# EAGLE design INKY.PCB (EAGLE 6.5.0)
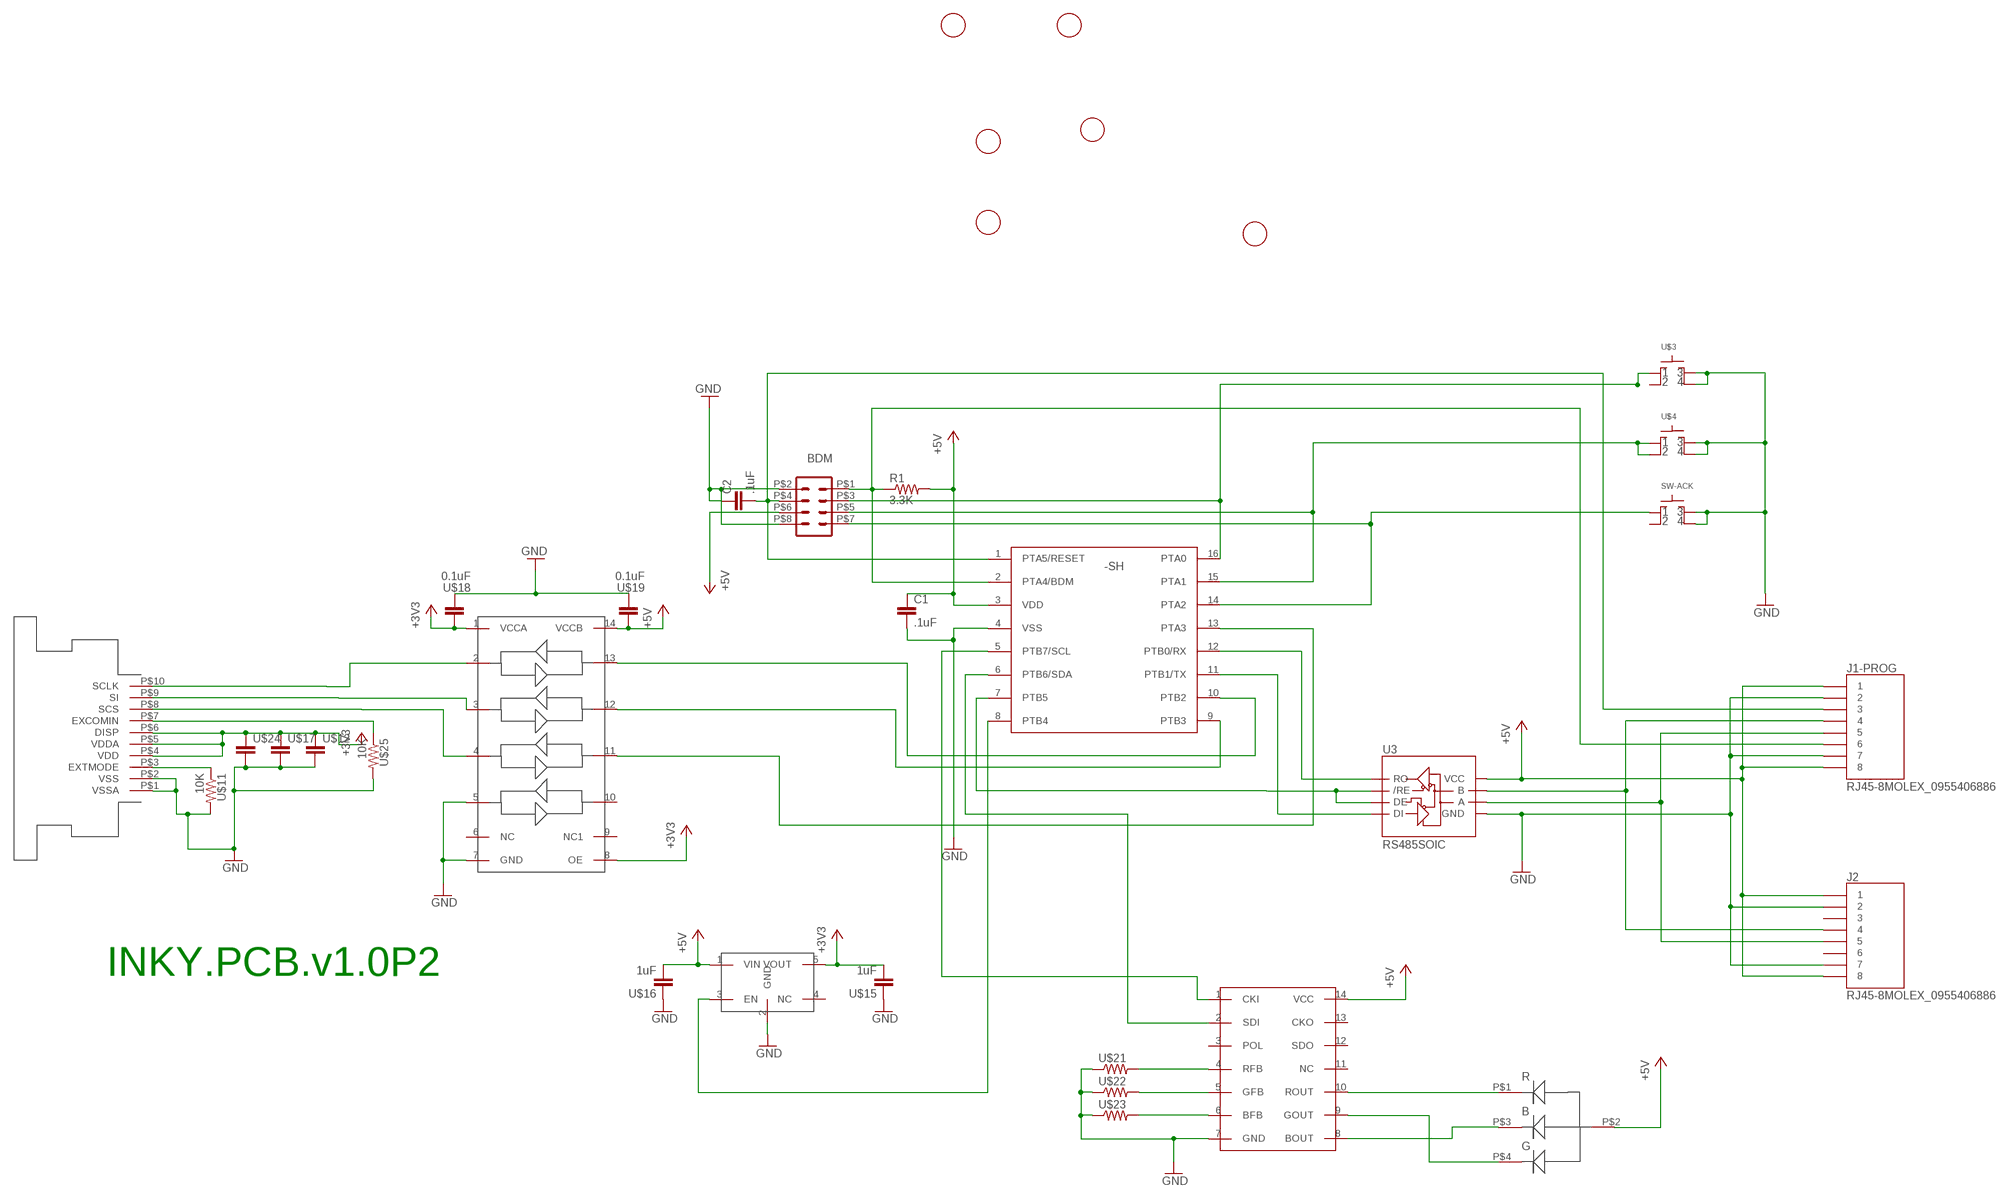
[diagram p0: schematic, sheet 1]

## Parts
BDM  TP2X4SMD  [SMD4X2]
C1  .1uF  RF-C0805  [C0805]
C2  .1uF  RF-C0805  [C0805]
J1-PROG  RJ45-8MOLEX_0955406886  [RJ45_GUIDE]
J2  RJ45-8MOLEX_0955406886  [RJ45_GUIDE]
R1  3.3K  RF-R0805  [RF-C0805]
SW-ACK  SWITCH-TACTILE-5E/5GSH9  [SWITCH_TACTILE-5E/5GSH9]
U1  MC9S08SH8CTG  [TSSOP16]
U3  RS485SOIC  [SO08]
U$1  FIDUCIAL  [FIDUCIAL_1MM]
U$2  FIDUCIAL  [FIDUCIAL_1MM]
U$3  SWITCH-TACTILE  [ESWITCH-TL3301PF]
U$4  SWITCH-TACTILE  [ESWITCH-TL3301PF]
U$5  WS2801  [SO14]
U$6  FIDUCIAL  [FIDUCIAL_1MM]
U$7  FIDUCIAL  [FIDUCIAL_1MM]
U$8  FIDUCIAL  [FIDUCIAL_1MM]
U$9  FIDUCIAL  [FIDUCIAL_1MM]
U$10  52745-1097  [FPC]
U$11  10K  RF-R0805  [RF-C0805]
U$12  RF-C0805  [C0805]
U$13  AAT3221IGV-3.3-T1  [SOT23-5]
U$14  TXB0104  [PW_R-PDSO-G14]
U$15  1uF  RF-C0805  [C0805]
U$16  1uF  RF-C0805  [C0805]
U$17  RF-C0805  [C0805]
U$18  0.1uF  RF-C0805  [C0805]
U$19  0.1uF  RF-C0805  [C0805]
U$20  RGLBED  [PLCC4_SMALL]
U$21  RF-R0805  [RF-C0805]
U$22  RF-R0805  [RF-C0805]
U$23  RF-R0805  [RF-C0805]
U$24  RF-C0805  [C0805]
U$25  10K  RF-R0805  [RF-C0805]

## Nets
485N: J1-PROG.P$4 J2.P$4 U3.7(B)
485P: J1-PROG.P$5 J2.P$5 U3.6(A)
+5V [+5V]: BDM.P$6 C1.1 J1-PROG.P$1 J1-PROG.P$8 J2.P$1 J2.P$8 R1.2 U1.3(VDD) U3.8(VCC) U$5.14(VCC) U$13.1(VIN) U$14.14(VCCB) U$16.2 U$19.1 U$20.P$2(ANODE)
ACK: BDM.P$7 SW-ACK.P$1 U1.14(PTA2)
BDM: BDM.P$1 J1-PROG.P$6 R1.1 U1.2(PTA4/BDM)
DIR: U1.7(PTB5) U3.2(/RE) U3.3(DE)
GMD [+3V3]: U$10.P$4(VDD) U$10.P$5(VDDA) U$10.P$6(DISP) U$12.1 U$13.5(VOUT) U$14.1(VCCA) U$14.8(OE) U$15.2 U$17.1 U$18.1 U$24.1 ; supply symbol labelled +3V3
GND [GND]: BDM.P$2 BDM.P$8 C1.2 C2.1 J1-PROG.P$2 J1-PROG.P$7 J2.P$2 J2.P$7 SW-ACK.P$3 SW-ACK.P$4 U1.4(VSS) U3.5(GND) U$3.3 U$3.4 U$4.3 U$4.4 U$5.7(GND) U$10.P$1(VSSA) U$10.P$2(VSS) U$11.2 U$12.2 U$13.2(GND) U$14.5 U$14.7(GND) U$15.1 U$16.1 U$17.2 U$18.2 U$19.2 U$21.1 U$22.1 U$23.1 U$24.2 U$25.2
INC_DOWN: BDM.P$3 U1.16(PTA0) U$3.1
INC_UP: BDM.P$5 U1.15(PTA1) U$4.1 U$4.2
N$1: U1.8(PTB4) U$13.3(EN)
N$2: U$10.P$10(SCLK) U$14.2
N$3: U$10.P$9(SI) U$14.3
N$4: U$10.P$8(SCS) U$14.4
N$5: U1.6(PTB6/SDA) U$5.2(SDI)
N$6: U1.5(PTB7/SCL) U$5.1(CKI)
N$7: U$5.10(ROUT) U$20.P$1(RED)
N$8: U$5.9(GOUT) U$20.P$4(GREEN)
N$9: U$5.8(BOUT) U$20.P$3(BLUE)
N$10: U$5.4(RFB) U$21.2
N$11: U$5.5(GFB) U$22.2
N$12: U$5.6(BFB) U$23.2
N$29: U1.9(PTB3) U$14.12
N$30: U1.10(PTB2) U$14.13
N$31: U1.13(PTA3) U$14.11
N$32: U$10.P$3(EXTMODE) U$11.1
N$33: U$10.P$7(EXCOMIN) U$25.1
RST: BDM.P$4 C2.2 J1-PROG.P$3 U1.1(PTA5/RESET)
RX: U1.12(PTB0/RX) U3.1(RO)
TX: U1.11(PTB1/TX) U3.4(DI)
Unconnected: J2.P$3 J2.P$6 SW-ACK.P$2 U$3.2 U$5.3(POL) U$5.11(NC) U$5.12(SDO) U$5.13(CKO) U$13.4(NC) U$14.6(NC) U$14.9(NC1) U$14.10

## Notes on the sheet
- INKY.PCB.v1.0P2

## Library data of the parts
BDM = GW-devices:TP2X4SMD; NOTES: DNP
C1 C2 = GW-devices:RF-C: RF capacitor pads for FSL reference design; MFGN: Murata; MFGP: GRM155R61A104KA01D; PRICE: 0.02
J1-PROG J2 = GW-devices:RJ45-8: RJ45 Jack MFG part number 54602-908lf; PRICE: 0.89
R1 = GW-devices:RF-R: RF resistor pads for FSL reference design; MFGN: Panasonic; MFGP: ERJ-2GEJ332X; PRICE: 0.02
SW-ACK = GW-devices:SWITCH-TACTILE
U1 = GW-devices:MC9S08SH8CTG; MFGN: Freescale; MFGP: MC9S08SH8CTG; PRICE: 2.00
U3 = SparkFun:RS485; MFGN: Texas Instruments; MFGP: SN65HVD1781DR; PRICE: 4.29
U$1 U$2 U$6-U$9 = adafruit:FIDUCIAL: For use by pick and place machines to calibrate the vision/machine, 1mm By microbuilder.eu; NOTES: DNP
U$3 U$4 = GW-devices:SWITCH-TACTILE; MFGN: E-Switch; MFGP: TL3301PF160QG
U$5 = GW-devices:WS2801; MFGN: WorldSemi; MFGP: WS2801
U$10 = KW2:52745-1097; MFGN: Molex; MFGP: 52745-1097
U$11 U$21-U$23 U$25 = GW-devices:RF-R: RF resistor pads for FSL reference design; MFGP: CRCW080510K0FKEB
U$12 = GW-devices:RF-C: RF capacitor pads for FSL reference design; MFGP: C0805C106M4PACTU
U$13 = KW2:AAT3221IGV-3.3-T1
U$14 = texas:TXB0104; MFGN: Texas Instruments; MFGP: TXB0104PWR
U$15 U$16 U$18 U$19 = GW-devices:RF-C: RF capacitor pads for FSL reference design
U$17 = GW-devices:RF-C: RF capacitor pads for FSL reference design; MFGP: 0805YD105KAT2A
U$20 = KW2:RGLBED; MFGN: Cree, Inc.; MFGP: CLV1A-FKB-CK1N1G1BB7R4S3
U$24 = GW-devices:RF-C: RF capacitor pads for FSL reference design; MFGP: 0805YD104KAT2A

## Board
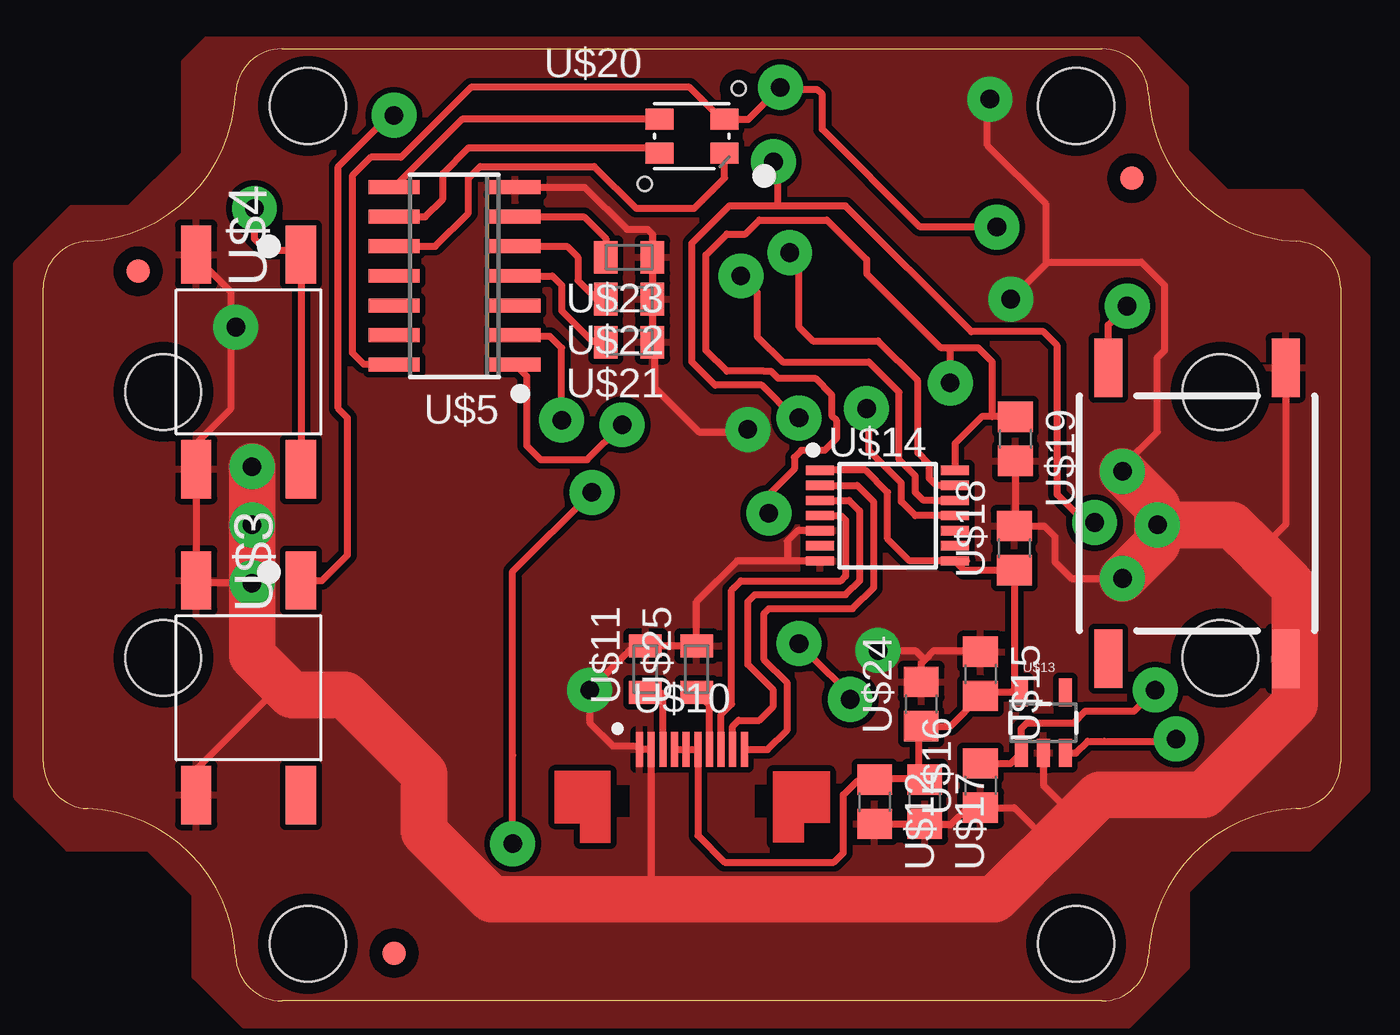
[diagram p1: board, top side]
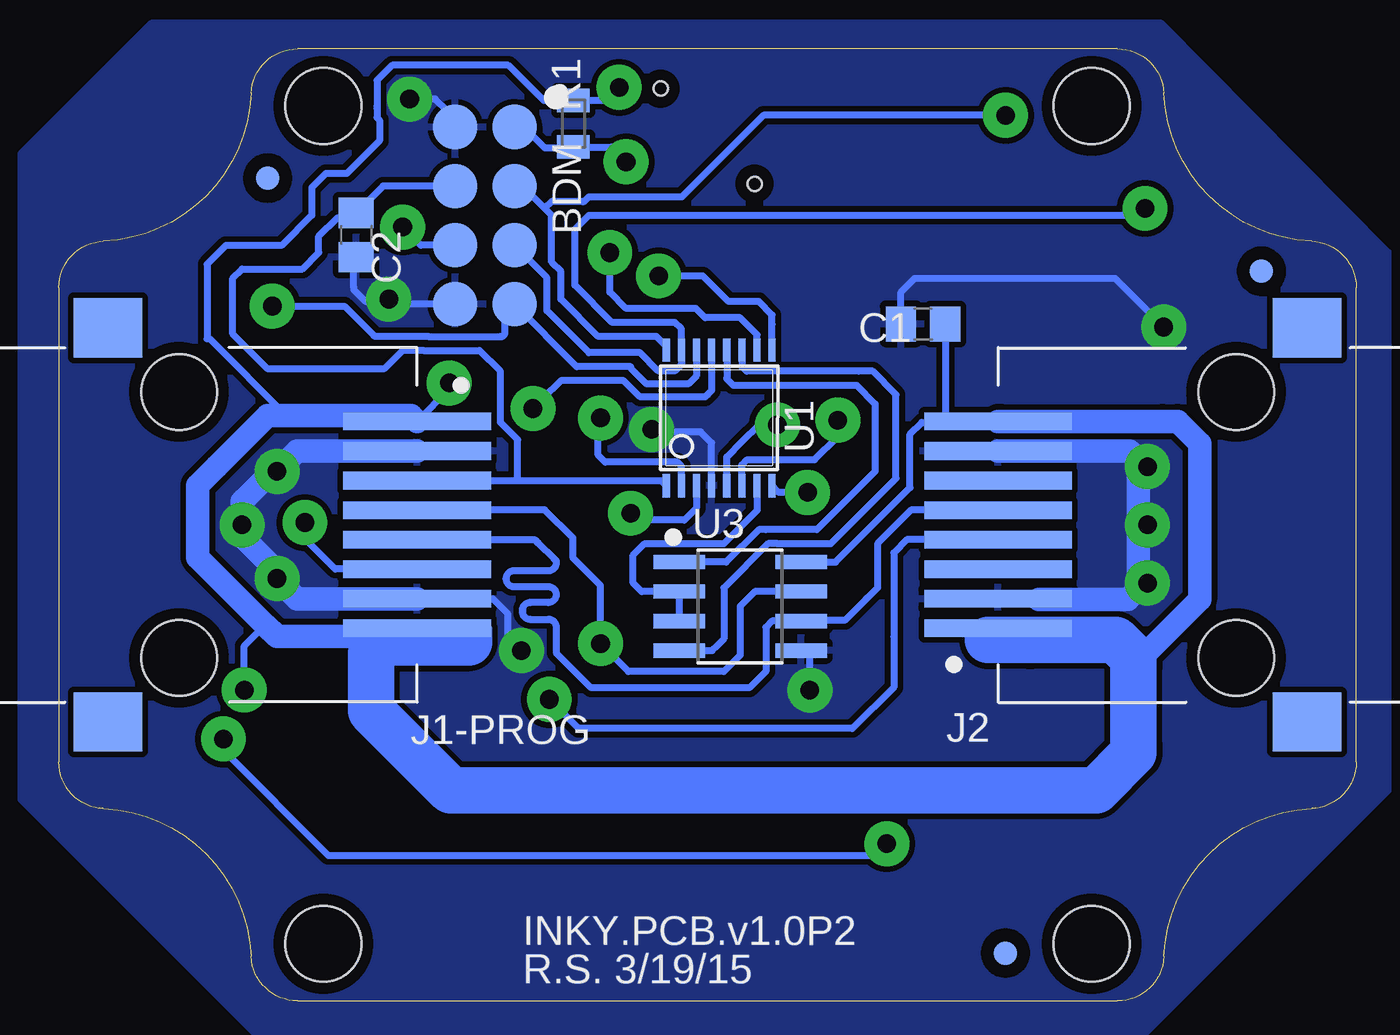
[diagram p2: board, bottom side, seen from below]

No outline drawn. Coordinates in mm, seen from the top.
Copper layers (1*16): Top 0.0356mm / dielectric 1.5011mm / Bottom 0.0356mm
Design rules "SilverCircuits *": minimum track width 7mil, minimum drill 14mil, track to track 0.25mm, track to pad 0.25mm, pad to pad 0.25mm, via to via 0.25mm, smd to smd 0.25mm, copper to edge 20mil, drill to drill 7mil, minimum pad ring 10mil, minimum via ring 8mil, stop-mask expansion 4mil, vias tented up to drill 0.5mm, thermal gap 10mil
Holes 3.26 mm at 16.5,-18 -16.5,-18 -16.5,18 16.5,18
Milling: 16 lines

### Footprints (pad centres in the part's own frame; a part is rotated, then mirrored left to right if it is on the bottom)
SMD4X2 = smd 1.905 x 1.905: P$1 0,0; P$2 0,-2.54; P$3 2.54,0; P$4 2.54,-2.54; P$5 5.08,0; P$6 5.08,-2.54; P$7 7.62,0; P$8 7.62,-2.54
C0805 = smd 1.3 x 1.5: 1 -0.95,0; 2 0.95,0
RJ45_GUIDE = smd 0.76 x 6.35: P$1 -4.445,0; P$2 -3.175,0; P$3 -1.905,0; P$4 -0.635,0; P$5 0.635,0; P$6 1.905,0; P$7 3.175,0; P$8 4.445,0 | smd 2.54 x 2.94: P$9 -8.465,-13.275; P$10 8.465,-13.275 | hole 3.25: -5.715,-10.225; 5.715,-10.225
RF-C0805 = smd 1 x 1.4: 1 -1,0; 2 1,0
SWITCH_TACTILE-5E/5GSH9 = smd 2.5 x 1.2: P$1 6.25,3.81; P$2 -6.25,3.81; P$3 6.25,-3.81; P$4 -6.25,-3.81
TSSOP16 = smd 0.305 x 0.991: 1 -2.275,-2.918; 2 -1.625,-2.918; 3 -0.975,-2.918; 4 -0.325,-2.918; 5 0.325,-2.918; 6 0.975,-2.918; 7 1.625,-2.918; 8 2.275,-2.918; 9 2.275,2.918; 10 1.625,2.918; 11 0.975,2.918; 12 0.325,2.918; 13 -0.325,2.918; 14 -0.975,2.918; 15 -1.625,2.918; 16 -2.275,2.918
SO08 = smd 0.61 x 2.21: 1 -1.905,-2.616; 2 -0.635,-2.616; 3 0.635,-2.616; 4 1.905,-2.616; 5 1.905,2.616; 6 0.635,2.616; 7 -0.635,2.616; 8 -1.905,2.616
FIDUCIAL_1MM = smd 1 x 1: 1 0,0
ESWITCH-TL3301PF = smd 2.5 x 1.3: 1 -4.61,2.25; 2 4.61,2.25; 3 -4.61,-2.25; 4 4.61,-2.25
SO14 = smd 0.6 x 2.2: 1 -3.81,-2.6; 2 -2.54,-2.6; 3 -1.27,-2.6; 4 0,-2.6; 5 1.27,-2.6; 6 2.54,-2.6; 7 3.81,-2.6; 8 3.81,2.6; 9 2.54,2.6; 10 1.27,2.6; 11 0,2.6; 12 -1.27,2.6; 13 -2.54,2.6; 14 -3.81,2.6
FPC = smd 0.3 x 1.5: P$1 -2.25,0.95; P$2 -1.75,0.95; P$3 -1.25,0.95; P$4 -0.75,0.95; P$5 -0.25,0.95; P$6 0.25,0.95; P$7 0.75,0.95; P$8 1.25,0.95; P$9 1.75,0.95; P$10 2.25,0.95
SOT23-5 = smd 0.55 x 1.2: 1 -0.95,-1.3; 2 0,-1.3; 3 0.95,-1.3; 4 0.95,1.3; 5 -0.95,1.3
PW_R-PDSO-G14 = smd 0.4 x 1.2: 1 -1.95,-2.9; 2 -1.3,-2.9; 3 -0.65,-2.9; 4 0,-2.9; 5 0.65,-2.9; 6 1.3,-2.9; 7 1.95,-2.9; 8 1.95,2.9; 9 1.3,2.9; 10 0.65,2.9; 11 0,2.9; 12 -0.65,2.9; 13 -1.3,2.9; 14 -1.95,2.9
PLCC4_SMALL = smd 1.2 x 0.9: P$1 1.4,-0.725; P$2 1.4,0.725; P$3 -1.4,0.725; P$4 -1.4,-0.725 | hole 0.61: 2.019,2.045; -2.019,-2.045

### Placement (x,y rotation side)
BDM  8.3,17.1 270 bottom
C1  -9.26,8.63 180 bottom
C2  15.09,12.46 90 bottom
J1-PROG  12.48,0 270 bottom
J2  -12.48,0 90 bottom
R1  5.76,17.24 90 bottom
SW-ACK  21.7,0.5 90 top
U1  -0.5,4.6 0 bottom
U3  -1.4,-3.5 270 bottom
U$1  -23.8,10.9 0 top
U$2  -12.8,-18.4 0 bottom
U$3  -19.05,-7 270 top
U$4  -19.05,7 270 top
U$5  -10.2,10.7 90 top
U$6  18.9,14.9 0 bottom
U$7  -23.8,10.9 0 bottom
U$8  -12.8,-18.4 0 top
U$9  18.9,14.9 0 top
U$10  0,-10.6 0 top
U$11  -2,-6.2 90 top
U$12  7.85,-11.9 270 top
U$13  15.1,-8.5 0 top
U$14  8.4,0.4 270 top
U$15  12.4,-6.4 270 top
U$16  12.4,-11.2 90 top
U$17  10,-11.9 270 top
U$18  13.85,-1 90 top
U$19  13.9,3.7 270 top
U$20  0,16.7 0 top
U$21  -2.7,7.85 180 top
U$22  -2.7,9.7 180 top
U$23  -2.7,11.5 180 top
U$24  9.85,-7.7 90 top
U$25  0.2,-6.2 90 top

### Tracks (layer width: path | path; a pad name or v marks a point on that pad's centre or on a via)
485N  (via drill 0.8 pad 1.93)
  Top 0.305: v6.8,-7.5 6.8,-7.3 5.1,-5.6 v4.6,-5.1
  Bottom 0.305: J1-PROG.P$4 10.96,0.64 10.95,0.65 7,0.65 5.8,-0.55 5.8,-1.4 4.6,-2.6 v4.6,-5.1 3.4,-6.3 -0.7,-6.3 -1.4,-5.6 -1.4,-3.5 -2.04,-2.87 U3.7 | J2.P$4 -8.56,-0.64 -8,-1.2 -8,-4.8 -8,-6.98 -6.22,-8.76 5.54,-8.76 v6.8,-7.5
485P
  Bottom 0.305: 7.42,-0.63 7.28,-0.78 | 7.28,-0.78 6.6,-1.45 6.55,-1.5 6.5,-1.55 6.5,-1.63 arc90 6.84,-1.97 8.32,-1.97 arc-90 8.66,-2.31 8.66,-2.31 arc-90 8.32,-2.65 6.84,-2.65 arc90 6.5,-3 arc90 6.84,-3.33 7.62,-3.33 arc-90 7.96,-3.67 7.96,-3.72 arc-90 7.62,-4.06 6.84,-4.06 arc90 6.5,-4.4 6.5,-5.5 5,-7 -1.8,-7 -2.5,-6.3 -2.5,-4.4 -2.75,-4.16 -2.77,-4.13 U3.6 -4.05,-4.1 -4.22,-4.1 -5.9,-4.1 -6.8,-3.2 | J1-PROG.P$5 7.42,-0.64 7.28,-0.78 | -6.9,-3.1 -6.8,-3.2 | J2.P$5 -8.73,0.64 -7.3,-0.8 -7.3,-2.7 -6.8,-3.2
+5V  (via drill 0.8 pad 1.93)
  Top 0.305: U$16.2 13.7,-10.25 U$13.1 14.15,-8.75 14.4,-8.5 16.4,-8.5 16.9,-8 18.5,-8 19,-8 v19.9,-7.1 | U$19.1 12.9,4.65 | 12.9,4.65 12.45,4.65 11.3,3.5 U$14.14 | U$5.14 -14.1,6.9 -14.6,7.4 -14.6,15 -13.8,15.8 -12.5,15.8 -9.5,18.8 -0.1,18.8 1.27,17.43 U$20.P$2 2.23,17.43 2.42,17.43 v3.8,18.8 3.9,18.7 5.4,18.7 5.6,18.5 5.6,17 9.8,12.8 v13.1,12.8 | v3.3,0.5 3.3,1.3 4.4,2.4 4.4,2.9 4.7,3.2 5.7,3.2 6.2,3.7 6.2,4.5 6,4.7 6,5.6 5.3,6.3 3.7,6.3 3.4,6.6 3.1,6.6 1.5,6.6 0.6,7.5 0.6,11.6 1.5,12.5 2.3,12.5 2.9,13.1 5.8,13.1 7.5,11.4 7.5,10.8 10.7,7.6 11.1,7.6 | 12.9,4.65 12.9,5.8 12.9,7 12.3,7.6 11.1,7.6 | v11.1,6.1 11.1,7.6
  Bottom 0.305: J1-PROG.P$8 10.6,-4.45 | 10.6,-4.45 9.4,-4.45 9.4,-4.89 | -14.21,-4.59 -13.85,-4.95 | J2.P$1 -12.48,-4.76 -12.3,-4.95 | -12.6,4.45 -12.61,4.45 -14.21,4.45 -10.35,4.45 -10.3,4.4 -10.2,4.4 | 12.7,4.8 12.8,4.7 | 18.1,4.7 21.4,8 21.5,8 21.5,11.2 20.7,12 18.3,12 17,13.3 17,14.5 16.4,15.1 15.5,15.1 14.2,16.4 14.1,16.5 14.1,17.4 14.2,17.5 14.2,17.9 | U3.8 -5.5,-1.59 -8.7,1.6 -8.7,3.9 -9.2,4.4 -10.2,4.4 | v3.8,18.8 3.8,18.5 4.06,18.24 4.16,18.24 R1.2 6.64,18.24 6.94,18.24 6.99,18.24 7.04,18.24 8.55,19.75 13.55,19.75 14.2,19.1 14.2,17.9 | 10.25,-5.05 10.25,-4.79 10.6,-4.45 | U1.3 0.47,0.72 1,0.2 2.9,0.2 3,0.2 v3.3,0.5 | BDM.P$6 12.32,12.02 v13.1,12.8 | v11.1,6.1 11.1,5.83 J1-PROG.P$1 | 14.2,18 14.2,17.9 | C1.1 -10.21,4.51 -10.2,4.5 -10.2,4.4 | v19.9,-7.1 19.9,-5.2 19,-4.3
  Bottom 1: J2.P$8 -12.6,4.45 -19.55,4.45 -20.2,4.45 -21.15,3.5 -21.15,-3.2 -18.3,-6.05 | 14.45,-5.5 15.15,-4.8 18.5,-4.8 19,-4.3 21.9,-1.4 21.9,1.7 21.1,2.5 18.9,4.7 18.7,4.7 18.6,4.7 18.1,4.7 12.8,4.7 12.74,4.7 J1-PROG.P$1
  Bottom 2: 10.25,-5.05 14,-5.05 14.45,-5.5 14.45,-8 11.05,-11.4 -16.7,-11.4 -18.3,-9.8 -18.3,-9.5 -18.3,-6.05 -18.3,-5.7 -17.55,-4.95 -13.85,-4.95 -12.3,-4.95 -12.05,-4.95
ACK  (via drill 0.8 pad 1.93)
  Top 0.305: SW-ACK.P$1 17.89,8.59 v18.7,9.4
  Bottom 0.305: U1.14 0.47,6.42 0.47,6.41 0.82,6.06 2.62,6.06 3.3,6.74 3.3,6.8 5.62,6.8 BDM.P$7 8.5,9.28 8.5,9 8.7,8.8 | 8.7,8.8 8.7,8.2 8.8,8.1 8.9,8.1 12,8.1 14.3,8.1 14.4,8.2 15.6,9.4 16.2,9.4 v18.7,9.4 | 8.7,8.8 8.7,8.98
BDM  (via drill 0.8 pad 1.93)
  Top 0.305: v17.3,0.1 16.9,0.1 15.7,1.3 15.7,7.6 15.7,7.7 15.1,8.3 12,8.3 6.6,13.7 3.7,13.7 | 3.7,13.7 1.6,13.7 0,12.1 0,7 1,6 3,6 4.4,4.6 v4.6,4.6 | 3.7,13.7 3.7,15.4 v3.5,15.6
  Bottom 0.305: J1-PROG.P$6 15.99,-1.91 17.3,-0.6 v17.3,0.1 | v3.5,15.6 4.14,16.24 R1.1 5.8,16.2 7,16.2 7.6,16.8 7.9,17.1 BDM.P$1 | U1.2 1.12,2.52 1.3,2.7 4.4,2.7 4.7,3 4.7,4.5 v4.6,4.6
DIR
  Bottom 0.305: U3.3 U3.2 2.83,-2.87 3.2,-2.5 3.2,-1.3 2.7,-0.8 -0.7,-0.8 -1,-0.5 -2.12,0.62 U1.7
GMD
  Top 0.305: U$14.8 11.8,-1.55 | U$10.P$4 U$10.P$5 U$10.P$6 0.25,-13.35 1.4,-14.5 6.1,-14.5 6.5,-14.1 6.5,-11.6 7.1,-11 7.6,-11 7.8,-11 U$12.1 7.8,-10.9 7.7,-10.9 9.75,-10.9 | 9.75,-10.9 9.75,-8.75 U$24.1 11.1,-8.65 U$15.2 12.55,-7.2 14,-7.2 | U$13.5 14,-7.2 | 14,-7.2 13.85,-7.05 U$18.1 11.7,-1.95 U$14.8 | U$14.8 9.35,-1.55 8.4,-0.6 8.4,1.4 7.45,2.35 U$14.1 | U$17.1 9.8,-10.95 9.75,-10.9
GND  (via drill 0.8 pad 1.93)
  Top 0.305: U$4.4 -21.3,2.2 | -21.3,2.2 -21.3,-0.05 U$3.3 -21.3,-2.5 v-18.9,-2.5 | 13.9,0 U$18.2 | -21.2,-11.61 U$3.4 -21.3,-10.5 -17.65,-6.85 | SW-ACK.P$3 25.51,0.01 24.35,-1.15 | U$5.7 -4.61,14.51 -2.8,12.7 -1.9,12.7 -1.7,12.5 U$23.1 U$22.1 -1.7,7.9 -1.6,7.8 | SW-ACK.P$4 25.56,-5.8 25.9,-5.8 | -1.8,-16.1 -1.8,-16.4 -1.75,-16.35 U$10.P$2 U$10.P$1 -2.4,-9.5 -3.4,-9.5 -4.39,-8.51 v-4.39,-7.1 -2.49,-5.2 U$11.2 U$25.2 0.2,-3.3 1.95,-1.55 2.05,-1.55 4.2,-1.55 | 9.85,-12.9 11.1,-12.9 11.85,-12.15 U$16.1 13.85,-12.15 15.4,-13.7 | U$12.2 U$17.2 | U$13.2 15.1,-11.2 16.5,-12.6 | U$14.7 4.2,-1.55 | U$14.5 4.55,-0.25 4.1,-0.7 4.1,-1.45 4.2,-1.55 | U$19.2 13.9,0 | 13.9,0 U$18.2 | -21.3,2.2 -21.3,3.5 -19.8,5 -19.8,8.5 | -19.8,8.5 -19.8,10 -21.3,11.5 U$4.3 | -1.6,7.8 -1.65,7.8 U$21.1 | U$24.2 9.85,-5.95 10,-5.8 | 10,-5.8 10.4,-5.4 12.35,-5.4 U$15.1 | v8,-5.4 9.6,-5.4 10,-5.8 | U$18.2 15.15,-0.05 15.6,-0.5 15.6,-1.6 16.3,-2.3 v18.5,-2.3 | 15.2,11.2 15.2,13.8 12.7,16.3 12.7,18.1 12.7,18.2 v12.8,18.3 | 15.2,11.2 v13.7,9.7 | v18.5,2.3 18.5,2.5 20,4 20,7.2 20.3,7.5 20.3,10.3 19.3,11.3 15.3,11.3 15.2,11.2 | -1.6,7.8 -1.6,5.9 0.3,4 2.3,4 v2.4,4.1 | v-19.6,8.5 -19.8,8.5
  Top 0.406: SW-ACK.P$4 25.51,-5.71 25.5,-5.7 25.7,-5.7
  Top 2: v20,0 20,0.8 v18.5,2.3 | v20,0 20,-0.8 v18.5,-2.3 | v-18.9,2.5 v-18.9,-2.5 -18.9,-5.6 -17.65,-6.85 -17.2,-7.3 -14.9,-7.3 -12.4,-9.8 -11.5,-10.7 -11.5,-13.2 -11.4,-13.3 -8.6,-16.1 -1.8,-16.1 10.2,-16.1 13,-16.1 14.4,-14.7 15.4,-13.7 16.5,-12.6 17.5,-11.6 22,-11.6 25.9,-7.7 25.9,-7.6 25.9,-5.8 25.9,-2.7 25.7,-2.5 24.35,-1.15 23.2,0 20.2,0 v20,0
  Bottom 0.305: -14.23,-3.2 -12.51,-3.2 J2.P$2 | v-4.39,-7.1 -4.39,-5.65 -4.15,-5.41 U3.5 | C2.1 15.2,11.4 15.2,10.2 15.2,10.1 14.7,9.6 13.8,9.6 v13.7,9.7 13.48,9.48 BDM.P$8 | J1-PROG.P$7 9.22,-3.17 8.6,-3.8 8.6,-4.8 v8,-5.4 | 11.04,17.64 11.2,17.8 | 11.2,17.8 11.7,18.3 v12.8,18.3 | BDM.P$2 10.84,17.44 11.2,17.8 | -18.5,-2.75 -18.65,-2.75 v-18.9,-2.5 | v-18.9,0 -18.9,-0.1 | U1.4 -0.17,3.52 0.3,4 2.3,4 v2.4,4.1 | C1.2 -8.31,10.01 -8.9,10.6 -17.5,10.6 v-19.6,8.5
  Bottom 1: J2.P$7 -18.12,3.17 -18.5,2.8 -18.5,-2.75 -18.05,-3.2 -14.23,-3.2 | J1-PROG.P$7 16.73,-3.17 17.62,-3.17 v18.5,-2.3 18.5,-2 20,-0.5 v20,0 20,1 19.9,1.1 18.7,2.3 v18.5,2.3 17.62,3.17 16.82,3.17 J1-PROG.P$2
  pour Top: -20.85,20.85 19.15,20.85 21.2,18.8 21.2,16.05 22.95,14.3 26.2,14.3 29,11.5 29,-11.4 26.5,-13.9 23.1,-13.9 21.25,-15.75 21.25,-19 18.75,-21.5 -19.25,-21.5 -21.35,-19.4 -21.35,-15.9 -23.35,-13.9 -26.8,-13.9 -29,-11.7 -29,11.25 -26.65,13.6 -24.15,13.6 -21.8,15.95 -21.8,19.9
  pour Bottom: -19.5,21.55 23.9,21.55 29.5,15.95 29.5,-11.8 19.05,-22.25 -18.4,-22.25 -29.25,-11.4 -29.25,11.7
INC_DOWN  (via drill 0.8 pad 1.93)
  Top 0.305: -16.8,-2.65 -16.75,-2.6 -16.75,-2.54 -16.8,-2.49 U$3.1 -15.89,-2.39 -14.8,-1.3 -14.8,4.6 -15.2,5 -15.2,15.4 -13.9,16.7 -13,17.6 v-12.8,17.6
  Bottom 0.305: 8.46,14.3 8.3,14.3 8.24,14.3 | 7,13.6 6.7,13.3 6.7,11.3 6.3,10.9 6.3,9.7 4.7,8.1 2.2,8.1 1.77,7.67 U1.16 | 7,13.6 7.7,14.3 8.24,14.3 | v-12.8,17.6 -2.4,17.6 1.1,14.1 5.1,14.1 5.3,13.9 5.4,13.9 6.7,13.9 7,13.6 | 8.24,14.3 8.24,14.5 BDM.P$3
INC_UP  (via drill 0.8 pad 1.93)
  Top 0.305: U$4.2 U$4.1 -16.99,11.8 -18.3,11.8 -18.8,12.3 v-18.8,13.6
  Bottom 0.305: v-18.8,13.6 -18.5,13.3 4.5,13.3 5.1,13.3 5.7,12.7 5.7,11.3 5.7,10.3 4.1,8.7 1.4,8.7 1.12,8.43 U1.15 1.12,6.88 1.15,6.88 1.4,6.62 2.1,6.62 2.12,6.62 2.9,7.4 5.1,7.4 6.9,9.2 6.9,10.32 6.9,10.62 BDM.P$5
N$1  (via drill 0.8 pad 1.93)
  Top 0.305: U$13.3 16.1,-9.8 16.5,-9.8 17,-9.3 17.7,-9.3 20,-9.3 20.7,-9.3 v20.8,-9.2 | v-4.3,1.4 -7.7,-2 -7.7,-9.9 v-7.7,-13.7
  Bottom 0.305: v-7.7,-13.7 -7.2,-14.2 15,-14.2 16.3,-14.2 20.8,-9.7 v20.8,-9.2 | v-4.3,1.4 -3.06,1.4 U1.8
N$2
  Top 0.305: U$10.P$10 3.25,-9.65 4.1,-8.8 4.1,-6.8 3.1,-5.8 3.1,-3.8 3.3,-3.6 6.9,-3.6 7.8,-2.7 7.8,1 7.1,1.7 U$14.2
N$3
  Top 0.305: U$10.P$9 1.75,-8.65 2,-8.4 2.9,-8.4 3.5,-7.8 3.5,-7.1 2.4,-6 2.4,-3.3 2.7,-3 6.6,-3 7.2,-2.4 7.2,0.6 6.75,1.05 U$14.3
N$4
  Top 0.305: U$10.P$8 1.25,-8.15 1.7,-7.7 1.7,-2.8 1.8,-2.7 2.1,-2.4 6.4,-2.4 6.6,-2.2 6.6,0.2 6.4,0.4 U$14.4
N$5  (via drill 0.8 pad 1.93)
  Top 0.305: U$5.2 -7.54,8.1 -6.1,8.1 -5.6,7.6 v-5.6,4.5
  Bottom 0.305: U1.6 -1.48,2.58 -1.7,2.8 -4.6,2.8 -5.6,3.8 v-5.6,4.5
N$6  (via drill 0.8 pad 1.93)
  Top 0.305: U$5.1 -7.1,6.39 -7.1,3.4 -6.5,2.8 -4.5,2.8 v-3,4.3
  Bottom 0.305: U1.5 -0.82,2.92 -1.5,3.6 -2.2,4.3 v-3,4.3
N$7
  Top 0.305: U$5.10 -11.03,11.97 -9.6,13.4 -9.6,14.9 -9.1,15.4 -4.2,15.4 -2.4,13.6 0.1,13.6 1.4,14.9 U$20.P$1
N$8
  Top 0.305: U$5.9 -11.46,13.24 -10.7,14 -10.7,15.1 -9.6,16.2 -1.62,16.2 U$20.P$4
N$9
  Top 0.305: U$20.P$3 -9.88,17.43 U$5.8
N$10
  Top 0.305: U$5.4 -6,10.7 -5.6,10.3 -5.6,9.2 -4.3,7.9 -3.75,7.9 U$21.2
N$11
  Top 0.305: U$5.5 -5.37,11.97 -4.9,11.5 -4.9,10.5 -4.1,9.7 U$22.2
N$12
  Top 0.305: U$5.6 -4.64,13.24 -3.7,12.3 U$23.2
N$29  (via drill 0.8 pad 1.93)
  Top 0.305: U$14.12 11.25,1.05 10.4,1.05 9.95,1.05 9.6,1.4 9.6,2.1 8.9,2.8 8.9,5.7 7.6,7 3.9,7 2.8,8.1 2.8,10 2.5,10.3 v2.1,10.7
  Bottom 0.305: U1.9 -2.77,8.62 -2.77,9.03 -2.2,9.6 -0.9,9.6 0.2,10.7 v2.1,10.7
N$30  (via drill 0.8 pad 1.93)
  Top 0.305: U$14.13 10.5,1.7 10.2,2 10.2,2.6 9.7,3.1 9.7,6.2 8,7.9 5.2,7.9 4.6,8.5 4.6,11.1 4.6,11.3 v4.2,11.7
  Bottom 0.305: U1.10 -2.12,8.18 -1.4,8.9 0.1,8.9 0.5,9.3 3.5,9.3 4.2,10 v4.2,11.7
N$31  (via drill 0.8 pad 1.93)
  Top 0.305: U$14.11 11.5,0.4 U$14.11 | U$14.11 9.6,0.4 9,1 9,1.8 7.6,3.2 7.6,4.9 v7.5,5 7.4,5.1
  Bottom 0.305: U1.13 -0.17,5.88 -0.17,5.78 0,5.6 0.1,5.5 0.3,5.5 2.9,5.5 3.6,6.2 6.3,6.2 7.1,5.4 7.4,5.1 v7.5,5
N$32
  Top 0.305: U$10.P$3 -1.25,-7.3 | -1.25,-7.3 -1.25,-7.25 | U$11.1 -1.35,-7.2 -1.25,-7.3
N$33
  Top 0.305: U$10.P$7 0.75,-8.15 0.75,-7.75 U$25.1
RST
  Bottom 0.305: J1-PROG.P$3 8.16,1.91 | 8.16,1.91 2,1.91 U1.1 | 8.16,1.91 8.16,3.66 8.9,4.4 8.9,5.8 8.9,6.6 9.8,7.5 12.2,7.5 13.1,7.5 13.9,6.7 14.9,6.7 18.9,6.7 20.4,8.2 20.4,10.6 20,11 17.4,11 16.7,11.7 16.7,12.4 15.9,13.2 15.3,13.2 C2.2 14.24,14.26 13.94,14.56 BDM.P$4
RX
  Bottom 0.305: U1.12 -0.82,6.33 -0.82,6.28 -1.1,6 -6.2,6 -6.4,6 -7.2,5.2 -7.2,2.3 -4.7,-0.2 -2.5,-0.2 -2.2,-0.2 -0.8,-1.6 U3.1
TX
  Bottom 0.305: U3.4 -0.2,-5.41 -0.45,-5.15 | -0.45,-5.15 -0.6,-5 | U1.11 -1.48,6.8 -1.68,6.6 -6.5,6.6 -7.1,6.6 -8.1,5.6 -8.1,2 -5.3,-0.8 -5,-0.8 -3,-0.8 -2.6,-0.8 -0.7,-2.7 -0.7,-4.9 -0.45,-5.15

### Text on the board
bPlace: INKY.PCB.v1.0P2 | R.S. 3/19/15